# Altium schematic sheet TJA1020.SchDoc
size A4
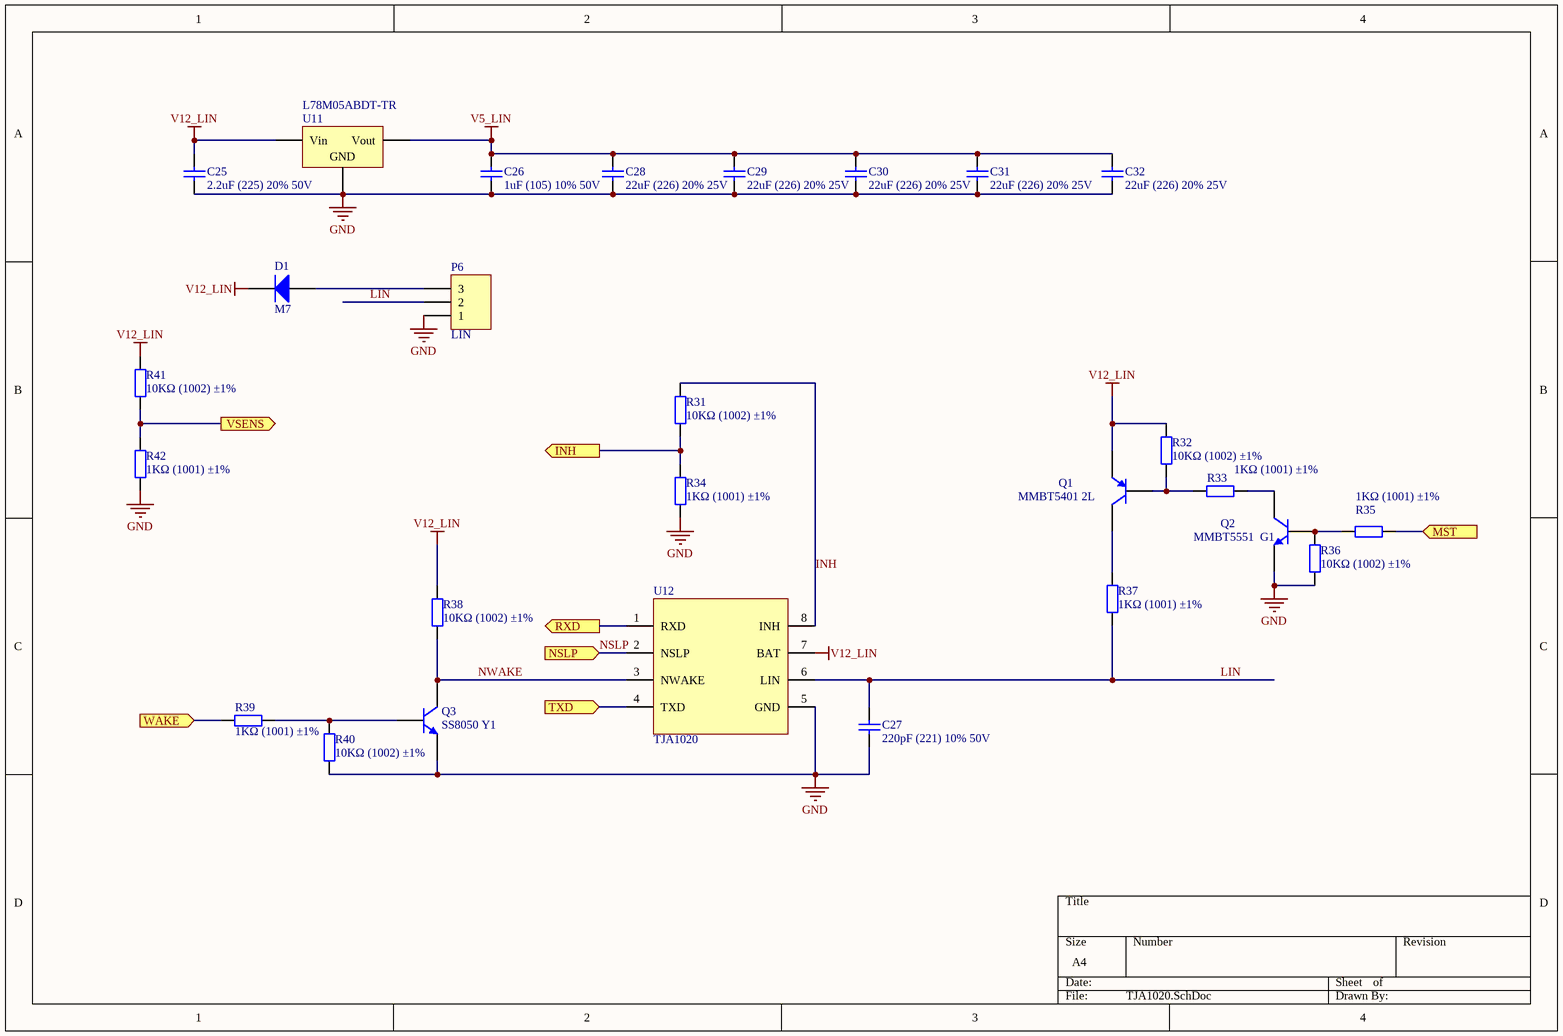
[diagram p0: TJA1020.SchDoc]

## Parts
C25  2.2uF (225) 20% 50V  [0805_C]
C26  1uF (105) 10% 50V  [0603_C]
C27  220pF (221) 10% 50V  [0402_C]
C28  22uF (226) 20% 25V  [0805_C]
C29  22uF (226) 20% 25V  [0805_C]
C30  22uF (226) 20% 25V  [0805_C]
C31  22uF (226) 20% 25V  [0805_C]
C32  22uF (226) 20% 25V  [0805_C]
D1  M7  [SMA(DO-214AC)_S1]
P6  LIN  [WJ2EDGRC-5.08-3PxxR]
Q1  MMBT5401 2L  [SOT-23(SOT-23-3)]
Q2  MMBT5551  G1  [SOT-23(SOT-23-3)]
Q3  SS8050 Y1  [SOT-23(SOT-23-3)]
R31  10KΩ (1002) ±1%  [0402_R]
R32  10KΩ (1002) ±1%  [0402_R]
R33  1KΩ (1001) ±1%  [0402_R]
R34  1KΩ (1001) ±1%  [0402_R]
R35  1KΩ (1001) ±1%  [0402_R]
R36  10KΩ (1002) ±1%  [0402_R]
R37  1KΩ (1001) ±1%  [0805_R]
R38  10KΩ (1002) ±1%  [0402_R]
R39  1KΩ (1001) ±1%  [0402_R]
R40  10KΩ (1002) ±1%  [0402_R]
R41  10KΩ (1002) ±1%  [0402_R]
R42  1KΩ (1001) ±1%  [0402_R]
U11  L78M05ABDT-TR  [TO-252-2-180]
U12  TJA1020  [SOP-8_150mil]

## Ports
INH (out), MST (in), NSLP (in), RXD (out), TXD (in), VSENS (out), WAKE (in)

## Nets
GND: C25.1 C26.1 C27.1 C28.1 C29.2 C30.2 C31.2 C32.1 P6.1 Q2.2(E) Q3.2(E) R34.1 R36.1 R40.1 R42.1 U11.2(GND) U12.5(GND)
V5_LIN: C26.2 C28.2 C29.1 C30.1 C31.1 C32.2 U11.3(Vout)
V12_LIN: C25.2 D1.2(K) Q1.2(E) R32.2 R38.2 R41.2 U11.1(Vin) U12.7(BAT)
INH: R31.2 U12.8(INH)
INH: R31.1 R34.2 ; port INH  [a separate net that carries the same name]
LIN: C27.2 P6.2 R37.1 U12.6(LIN)
MST: R35.1 ; port MST
NSLP: U12.2(NSLP) ; port NSLP
NWAKE: Q3.3(C) R38.1 U12.3(NWAKE)
RXD: U12.1(RXD) ; port RXD
TXD: U12.4(TXD) ; port TXD
VSENS: R41.1 R42.2 ; port VSENS
WAKE: R39.2 ; port WAKE
NetD1_1: D1.1(A) P6.3
NetQ1_1: Q1.1(B) R32.1 R33.2
NetQ1_3: Q1.3(C) R37.2
NetQ2_1: Q2.1(B) R35.2 R36.2
NetQ2_3: Q2.3(C) R33.1
NetQ3_1: Q3.1(B) R39.1 R40.2

## Library data of the parts
C25 = 0805 2.2uF (225) 20% 50V: 贴片电容; ComponentLink1Description: 供应商链接; ComponentLink1URL: http://www.szlcsc.com/product/details_50225.html; Package: 0805; Supplier: LC; SuppliersPartNumber: C49217
C26 = 0603 1uF (105) 10% 50V: 贴片电容; ComponentLink1Description: 供应商链接; ComponentLink1URL: http://www.szlcsc.com/product/details_16531.html; Package: 0603; Supplier: LC; SuppliersPartNumber: C15849
C27 = 0402 220pF (221) 10% 50V: 贴片电容; ComponentLink1Description: 供应商链接; ComponentLink1URL: http://www.szlcsc.com/product/details_1882.html; Package: 0402; Supplier: LC; SuppliersPartNumber: C1530
C28-C32 = 0805 22uF (226) 20% 25V: 贴片电容; ComponentLink1Description: 供应商链接; ComponentLink1URL: http://www.szlcsc.com/product/details_46786.html; Package: 0805; Supplier: LC; SuppliersPartNumber: C45783
D1 = SMA(DO-214AC) M7: 二极管; 备注: 1N4007 4007 编号C2464 已经停售, 使用新物料编号C95872; ComponentLink1Description: 供应商链接; ComponentLink1URL: http://www.szlcsc.com/product/details_2841.html; Package: SMA(DO-214AC); Supplier: LC; SuppliersPartNumber: C95872
P6 = Header 3: Header, 3-Pin; LatestRevisionDate: 17-Jul-2002; LatestRevisionNote: Re-released for DXP Platform.; Publisher: Altium Limited
Q1 = SOT-23 MMBT5401 2L: 三极管; ComponentLink1Description: 供应商链接; ComponentLink1URL: http://www.szlcsc.com/product/details_8818.html; Package: SOT-23; Supplier: LC; SuppliersPartNumber: C8326
Q2 = SOT-23 MMBT5551  G1: 三极管; ComponentLink1Description: 供应商链接; ComponentLink1URL: http://www.szlcsc.com/product/details_2502.html; Package: SOT-23; Supplier: LC; SuppliersPartNumber: C2145
Q3 = SOT-23 SS8050 Y1: 三极管; ComponentLink1Description: 供应商链接; ComponentLink1URL: http://www.szlcsc.com/product/details_2507.html; Package: SOT-23; Supplier: LC; SuppliersPartNumber: C2150
R31 R32 R36 R38 R40 R41 = 0402 10KΩ (1002) 1%: 贴片电阻; ComponentLink1Description: 供应商链接; ComponentLink1URL: http://www.szlcsc.com/product/details_26487.html; Package: 0402; Supplier: LC; SuppliersPartNumber: C25744
R33-R35 R39 R42 = 0402 1KΩ (1001) 1%: 贴片电阻; ComponentLink1Description: 供应商链接; ComponentLink1URL: http://www.szlcsc.com/product/details_12256.html; Package: 0402; Supplier: LC; SuppliersPartNumber: C11702
R37 = 0805 1KΩ (1001) 1%: 贴片电阻; ComponentLink1Description: 供应商链接; ComponentLink1URL: http://www.szlcsc.com/product/details_18201.html; Package: 0805; Supplier: LC; SuppliersPartNumber: C17513
U11 = TO-252-2 L78M05ABDT-TR: 低压差线性稳压(LDO); ComponentLink1Description: 供应商链接; ComponentLink1URL: http://www.szlcsc.com/product/details_59107.html; Package: TO-252-2; Supplier: LC; SuppliersPartNumber: C58069